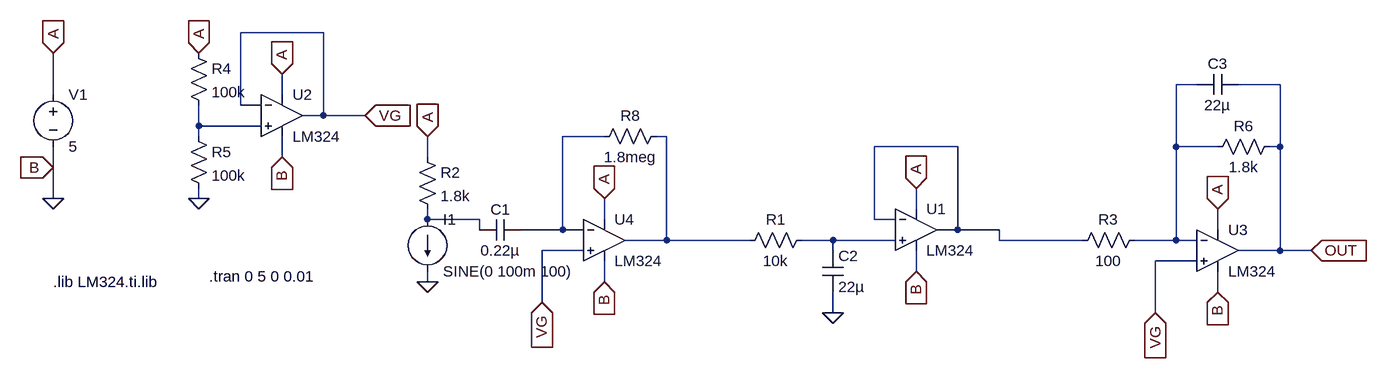
[diagram p0: schematic a.asc]
a.asc, the LTspice schematic file:
Version 4
SHEET 1 880 680
WIRE -800 -432 -928 -432
WIRE 544 -352 512 -352
WIRE 672 -352 608 -352
WIRE -1216 -336 -1216 -400
WIRE -864 -336 -864 -368
WIRE -928 -320 -928 -432
WIRE -896 -320 -928 -320
WIRE -800 -304 -800 -432
WIRE -800 -304 -832 -304
WIRE -736 -304 -800 -304
WIRE -992 -288 -992 -320
WIRE -896 -288 -992 -288
WIRE -992 -272 -992 -288
WIRE -368 -272 -432 -272
WIRE -272 -272 -288 -272
WIRE 176 -256 48 -256
WIRE 512 -256 512 -352
WIRE 576 -256 512 -256
WIRE 672 -256 672 -352
WIRE 672 -256 656 -256
WIRE -864 -240 -864 -272
WIRE -640 -240 -640 -272
WIRE -1216 -224 -1216 -256
WIRE -1216 -176 -1216 -224
WIRE -992 -176 -992 -192
WIRE 112 -160 112 -192
WIRE -640 -144 -640 -160
WIRE -560 -144 -640 -144
WIRE -368 -144 -368 -176
WIRE 48 -144 48 -256
WIRE 80 -144 48 -144
WIRE -560 -128 -560 -144
WIRE -432 -128 -432 -272
WIRE -432 -128 -496 -128
WIRE -400 -128 -432 -128
WIRE 176 -128 176 -256
WIRE 176 -128 144 -128
WIRE 240 -128 176 -128
WIRE 576 -128 576 -160
WIRE -272 -112 -272 -272
WIRE -272 -112 -336 -112
WIRE -144 -112 -272 -112
WIRE -16 -112 -64 -112
WIRE 80 -112 -16 -112
WIRE 240 -112 240 -128
WIRE 368 -112 240 -112
WIRE 512 -112 512 -256
WIRE 512 -112 448 -112
WIRE 544 -112 512 -112
WIRE -400 -96 -464 -96
WIRE -16 -96 -16 -112
WIRE 672 -96 672 -256
WIRE 672 -96 608 -96
WIRE 720 -96 672 -96
WIRE 544 -80 480 -80
WIRE 112 -64 112 -96
WIRE -640 -48 -640 -64
WIRE -368 -48 -368 -80
WIRE 576 -32 576 -64
WIRE -464 -16 -464 -96
WIRE -16 0 -16 -32
WIRE 480 0 480 -80
FLAG -1216 -176 0
FLAG -1216 -400 A
IOPIN -1216 -400 In
FLAG -992 -176 0
FLAG -864 -368 A
IOPIN -864 -368 In
FLAG -864 -240 B
IOPIN -864 -240 In
FLAG -1216 -224 B
IOPIN -1216 -224 In
FLAG -736 -304 VG
IOPIN -736 -304 In
FLAG -992 -400 A
IOPIN -992 -400 In
FLAG 576 -160 A
IOPIN 576 -160 In
FLAG 576 -32 B
IOPIN 576 -32 In
FLAG 480 0 VG
IOPIN 480 0 In
FLAG -368 -176 A
IOPIN -368 -176 In
FLAG -368 -48 B
IOPIN -368 -48 In
FLAG -464 -16 VG
IOPIN -464 -16 In
FLAG 112 -192 A
IOPIN 112 -192 In
FLAG 112 -64 B
IOPIN 112 -64 In
FLAG -16 0 0
FLAG 720 -96 OUT
IOPIN 720 -96 In
FLAG -640 -272 A
IOPIN -640 -272 In
FLAG -640 -48 0
SYMBOL voltage -1216 -352 R0
WINDOW 123 0 0 Left 2
WINDOW 39 0 0 Left 2
SYMATTR InstName V1
SYMATTR Value 5
SYMBOL res -1008 -416 R0
SYMATTR InstName R4
SYMATTR Value 100k
SYMBOL res -1008 -288 R0
SYMATTR InstName R5
SYMATTR Value 100k
SYMBOL Opamps\\opamp2 -864 -368 R0
SYMATTR InstName U2
SYMATTR Value LM324
SYMBOL Opamps\\opamp2 576 -160 R0
SYMATTR InstName U3
SYMATTR Value LM324
SYMBOL res 464 -128 R90
WINDOW 0 0 56 VBottom 2
WINDOW 3 32 56 VTop 2
SYMATTR InstName R3
SYMATTR Value 100
SYMBOL res 672 -272 R90
WINDOW 0 0 56 VBottom 2
WINDOW 3 32 56 VTop 2
SYMATTR InstName R6
SYMATTR Value 1.8k
SYMBOL Opamps\\opamp2 -368 -176 R0
SYMATTR InstName U4
SYMATTR Value LM324
SYMBOL res -272 -288 R90
WINDOW 0 0 56 VBottom 2
WINDOW 3 32 56 VTop 2
SYMATTR InstName R8
SYMATTR Value 1.8meg
SYMBOL cap -496 -144 R90
WINDOW 0 0 32 VBottom 2
WINDOW 3 32 32 VTop 2
SYMATTR InstName C1
SYMATTR Value 0.22µ
SYMBOL res -48 -128 R90
WINDOW 0 0 56 VBottom 2
WINDOW 3 32 56 VTop 2
SYMATTR InstName R1
SYMATTR Value 10k
SYMBOL cap -32 -96 R0
SYMATTR InstName C2
SYMATTR Value 22µ
SYMBOL Opamps\\opamp2 112 -192 R0
SYMATTR InstName U1
SYMATTR Value LM324
SYMBOL cap 608 -368 R90
WINDOW 0 0 32 VBottom 2
WINDOW 3 32 32 VTop 2
SYMATTR InstName C3
SYMATTR Value 22µ
SYMBOL res -656 -256 R0
SYMATTR InstName R2
SYMATTR Value 1.8k
SYMBOL current -640 -144 R0
WINDOW 123 0 0 Left 2
WINDOW 39 0 0 Left 2
SYMATTR InstName I1
SYMATTR Value SINE(0 100m 100)
TEXT -1216 -48 Left 2 !.lib LM324.ti.lib
TEXT -976 -56 Left 2 !.tran 0 5 0 0.01

The netlist it stands for:
* a.asc
V1 A 0 5
R4 A N002 100k
R5 N002 0 100k
XU2 N002 VG A 0 VG LM324  ; pins In+ In- V+ V- OUT
XU3 VG N001 A 0 OUT LM324  ; pins In+ In- V+ V- OUT
R3 N001 N005 100
R6 OUT N001 1.8k
XU4 VG N003 A 0 N004 LM324  ; pins In+ In- V+ V- OUT
R8 N004 N003 1.8meg
C1 N003 N006 0.22µ
R1 N007 N004 10k
C2 N007 0 22µ
XU1 N007 N005 A 0 N005 LM324  ; pins In+ In- V+ V- OUT
C3 OUT N001 22µ
R2 A N006 1.8k
I1 N006 0 SINE(0 100m 100)
.lib LM324.ti.lib
.tran 0 5 0 0.01
.backanno
.end